# EAGLE design mp3431-led-boost-driver-17mm-mk-1.0.0 (EAGLE 9.2.2)
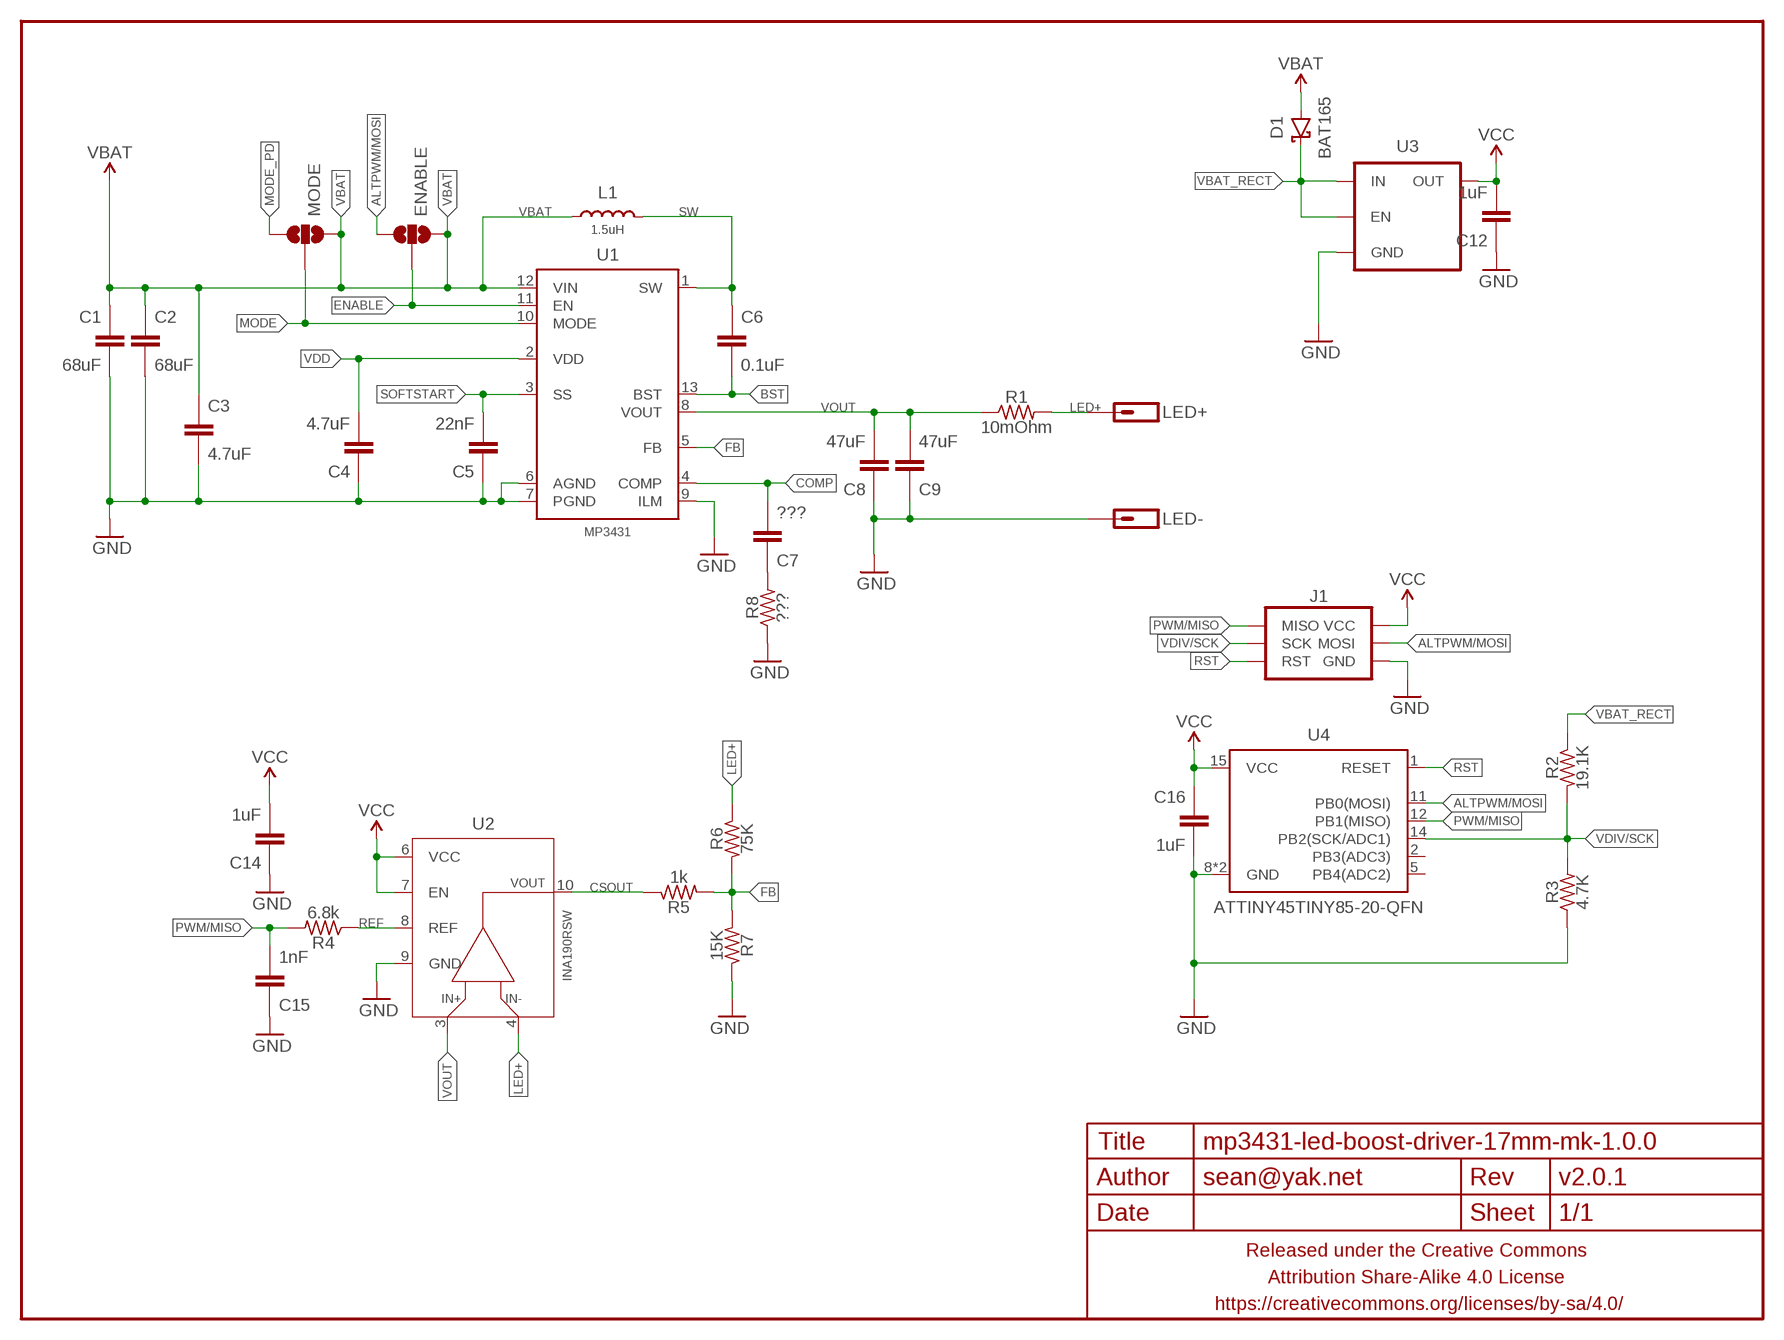
[diagram p0: schematic, sheet 1]

## Parts
C1  68uF  CAPACITOR-CERAMICC1206  [C1206]
C2  68uF  CAPACITOR-CERAMICC1206  [C1206]
C3  4.7uF  CAPACITOR-CERAMICC0402  [C0402]
C4  4.7uF  CAPACITOR-CERAMICC0402  [C0402]
C5  22nF  CAPACITOR-CERAMICC0402  [C0402]
C6  0.1uF  CAPACITOR-CERAMICC0402  [C0402]
C7  ???  CAPACITOR-CERAMICC0402  [C0402]
C8  47uF  CAPACITOR-CERAMICC1206  [C1206]
C9  47uF  CAPACITOR-CERAMICC1206  [C1206]
C12  1uF  CAPACITOR-CERAMICC0402  [C0402]
C14  1uF  CAPACITOR-CERAMICC0402  [C0402]
C15  1nF  CAPACITOR-CERAMICC0402  [C0402]
C16  1uF  CAPACITOR-CERAMICC0402  [C0402]
D1  BAT165  DIODE-SCHOTTKYSOD323  [SOD323-SCHOTTKY]
ENABLE  JUMPER-PAD-3-NOSMALL_BOX_SILK  [PAD-JUMPER-3-NO_YES_SILK_SMALL_BOX]
FRAME1  FRAME-LETTERNO_PACKAGE  [DUMMY]
J1  AVR_SPI_PRG_6SMD-1.27MM  [2X3-1.27MM-SMD]
L1  1.5uH  INDUCTORXAR7030  [XAR7030]
LED+  M01SMD-1.6MMX3.2MM  [1X01-SMD-1.6MMX3.2MM]
LED-  M01SMD-1.6MMX3.2MM  [1X01-SMD-1.6MMX3.2MM]
MODE  JUMPER-PAD-3-NOSMALL_BOX_SILK  [PAD-JUMPER-3-NO_YES_SILK_SMALL_BOX]
R1  10mOhm  RESISTORR1206  [R1206]
R2  19.1K  RESISTORR0402  [R0402]
R3  4.7K  RESISTORR0402  [R0402]
R4  6.8k  RESISTORR0402  [R0402]
R5  1k  RESISTORR0402  [R0402]
R6  75K  RESISTORR0402  [R0402]
R7  15K  RESISTORR0402  [R0402]
R8  ???  RESISTORR0402  [R0402]
U1  MP3431  [MP3431]
U2  INA190RSW  [UQFN-10]
U3  V_REG_ENTLV700  [SC70]
U4  ATTINY45TINY85-20-QFN  [QFN20]

## Nets
ALTPWM/MOSI: ENABLE.3 J1.4(MOSI) U4.11(PB0(MOSI))
BST: C6.2 U1.13(BST)
COMP: C7.2 U1.4(COMP)
COMP_MID: C7.1 R8.2
CSOUT: R5.1 U2.10(OUT)
ENABLE: ENABLE.2 U1.11(EN)
FB: R5.2 R6.2 R7.2 U1.5(FB)
GND: C1.2 C2.2 C3.2 C4.1 C5.1 C8.1 C9.1 C12.1 C14.1 C15.1 C16.2 J1.6(GND) LED-.P$1 R3.1 R7.1 R8.1 U1.6(AGND) U1.7(PGND) U1.9(ILM) U2.9(GND) U3.2(GND) U4.8(GND) U4.PAD(GND)
LED+: LED+.P$1 R1.2 R6.1 U2.4(VIN-)
MODE: MODE.2 U1.10(MODE)
MODE_PD: MODE.3
PWM/MISO: C15.2 J1.1(MISO) R4.2 U4.12(PB1(MISO))
REF: R4.1 U2.8(REF)
RST: J1.5(RST) U4.1(RESET)
SOFTSTART: C5.2 U1.3(SS)
SW: C6.1 L1.P$2 U1.1(SW)
VBAT: C1.1 C2.1 C3.1 D1.A ENABLE.1 L1.P$1 MODE.1 U1.12(VIN)
VBAT_RECT: D1.C R2.1 U3.1(IN) U3.3(EN)
VCC: C12.2 C14.2 C16.1 J1.2(VCC) U2.6(VCC) U2.7(EN) U3.5(OUT) U4.15(VCC)
VDD: C4.2 U1.2(VDD)
VDIV/SCK: J1.3(SCK) R2.2 R3.2 U4.14(PB2(SCK/ADC1))
VOUT: C8.2 C9.2 R1.1 U1.8(VOUT) U2.3(VIN+)
Unconnected: U4.2(PB3(ADC3)) U4.5(PB4(ADC2))

## Library data of the parts
C1-C9 C12 C14-C16 = a_parts:CAPACITOR-CERAMIC: CAPACITOR, European symbol
D1 = a_parts:DIODE-SCHOTTKY: Schottky diodes in SFE's production catalog BAT20J 1A 23V 0.62Vf RB751 120mA 40V 0.37Vf PMEG4005EJ 0.5A 40V 0.42Vf MBRA140 1A 40V 0.5Vf B340A 3A 40V SMA
ENABLE MODE = a_parts:JUMPER-PAD-3-NO
FRAME1 = a_parts:FRAME-LETTER: Schematic Frame Standard 8.5x11 US Letter frame; DESIGNER: sean@yak.net; VERSION: v2.0.1
J1 = a_parts:AVR_SPI_PRG_6: AVR ISP 6 Pin This is the reduced ISP connector for AVR programming. Common on Arduino. This footprint will take up less PCB space and can be used with a 10-pin to 6-pin adapter such as SKU: BOB-08508 **Special note about "TEST_POINT" package. The stop mask is on the top side, so if you want your programming test points to be on the bottom of your board, make sure to place this package on the bottom side of the board. This also ensure that the orientation to program from the bottom side will be correct.
L1 = a_parts:INDUCTOR: Inductors Basic Inductor/Choke - 0603 and 1206. Footprints are not proven and vary greatly between part numbers. SRN6045- 33uH, 20% 1.4A SDR0403-560KL - 56uH, 10%, 500mA RMS/740mA peak
LED+ LED- = a_parts:M01: Header 1 Standard 1-pin 0.1" header. Use with straight break away headers (SKU : PRT-00116), right angle break away headers (PRT-00553), swiss pins (PRT-00743), machine pins (PRT-00117), and female headers (PRT-00115).
R1-R8 = a_parts:RESISTOR: RESISTOR, American symbol
U1 = a_parts:MP3431
U2 = a_parts:INA190
U3 = a_parts:V_REG_EN
U4 = a_parts:ATTINY45: Atmel 8-pin 2/4/8kB flash uC

## Board
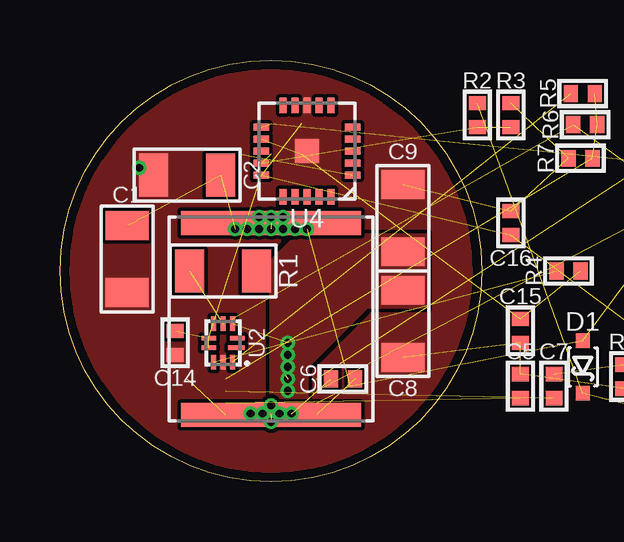
[diagram p1: board, top side]
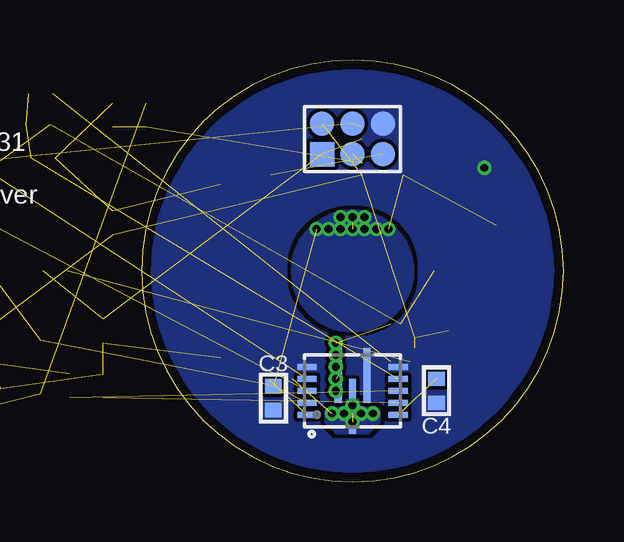
[diagram p2: board, bottom side, seen from below]

Size 17.6 x 17.6 mm. Coordinates in mm from the lower left corner, seen from the top.
Outline: 17.6,8.8 arc-180 0,8.8 arc-180 17.6,8.8
Copper layers (1*16): Top 0.035559375mm / dielectric 1.6mm / Bottom 0.035559375mm
Design rules "oshpark-2layer": minimum track width 6mil, minimum drill 10mil, track to track 6mil, track to pad 6mil, pad to pad 6mil, via to via 6mil, smd to smd 0mil, copper to edge 15mil, drill to drill 6mil, minimum pad ring 5mil, minimum via ring 5mil, stop-mask expansion 2.5mil, vias tented up to drill 20mil, thermal gap 10mil

### Footprints (pad centres in the part's own frame; a part is rotated, then mirrored left to right if it is on the bottom)
C1206 = smd 1.2 x 1.8: 1 -1.4,0; 2 1.4,0
C0402 = smd 0.6 x 0.7: 1 -0.5,0; 2 0.5,0
SOD323-SCHOTTKY = smd 0.6 x 0.6: A -1.1,0; C 1.1,0
PAD-JUMPER-3-NO_YES_SILK_SMALL_BOX = smd 0.8 x 1: 1 -1,0; 2 0,0; 3 1,0
2X3-1.27MM-SMD = smd 1.016 x 1.016: 1 -1.27,-0.635; 2 -1.27,0.635; 3 0,-0.635; 4 0,0.635; 5 1.27,-0.635; 6 1.27,0.635
XAR7030 = smd 1 x 7.5: P$1 -4,0; P$2 4,0
1X01-SMD-1.6MMX3.2MM = smd 1.6 x 3.2: P$1 0,0
R1206 = smd 1.2 x 1.8: 1 -1.4,0; 2 1.4,0
R0402 = smd 0.6 x 0.7: 1 -0.5,0; 2 0.5,0
MP3431 = smd 2.3 x 0.3: 1 -0.65,0; 7 0.65,-0.6; 8 0.65,0.6 | smd 0.25 x 0.8: 2 -1,-1.9; 3 -0.5,-1.9; 4 0,-1.9; 5 0.5,-1.9; 6 1,-1.9; 9 1,1.9; 10 0.5,1.9; 11 0,1.9; 12 -0.5,1.9; 13 -1,1.9
UQFN-10 = smd 0.2 x 0.7: 1 -0.2,-0.55 | smd 0.2 x 0.6: 2 0.2,-0.6; 6 0.2,0.6; 7 -0.2,0.6 | smd 0.6 x 0.2: 3 0.8,-0.4; 4 0.8,0; 5 0.8,0.4; 8 -0.8,0.4; 9 -0.8,0; 10 -0.8,-0.4
SC70 = smd 0.4 x 0.9: 1 -0.65,-1.1; 2 0,-1.1; 3 0.65,-1.1; 4 0.65,1.1; 5 -0.65,1.1
QFN20 = smd 0.65 x 0.3: 1 -1.9,1; 2 -1.9,0.5; 3 -1.9,0; 4 -1.9,-0.5; 5 -1.9,-1; 11 1.9,-1; 12 1.9,-0.5; 13 1.9,0; 14 1.9,0.5; 15 1.9,1 | smd 0.3 x 0.65: 6 -1,-1.9; 7 -0.5,-1.9; 8 0,-1.9; 9 0.5,-1.9; 10 1,-1.9; 16 1,1.9; 17 0.5,1.9; 18 0,1.9; 19 -0.5,1.9; 20 -1,1.9 | smd 1 x 1: PAD 0,0

### Placement (x,y rotation side)
C1  2.8,9.3 270 top
C2  5.3,12.8 180 top
C3  12.1,3.5 270 bottom
C4  5.3,3.8 90 bottom
C5  19.2,4 270 top
C6  11.8,4.3 0 top
C7  20.6,4 270 top
C8  14.3,6.6 90 top
C9  14.3,11 270 top
C12  29.2,4.7 90 top  (outside the outline)
C14  4.8,5.8 90 top
C15  19.2,6.3 90 top
C16  18.8,10.8 90 top
D1  21.8,4.8 270 top  (outside the outline)
ENABLE  28,12.9 180 bottom  (outside the outline)
FRAME1  -0.2,-0.2 270 top
J1  8.8,14.3 0 bottom
L1  8.8,6.8 270 top
LED+  29,9.4 145 top  (outside the outline)
LED-  24.9,7.8 180 top  (outside the outline)
MODE  27.6,15.3 180 bottom  (outside the outline)
R1  6.8,8.8 180 top
R2  17.4,15.3 270 top
R3  18.8,15.3 270 top
R4  21.2,8.8 0 top  (outside the outline)
R5  21.8,16.2 0 top  (outside the outline)
R6  21.9,14.9 0 top  (outside the outline)
R7  21.7,13.5 0 top  (outside the outline)
R8  23.5,4.4 90 top  (outside the outline)
U1  8.8,3.8 90 bottom
U2  6.8,5.8 90 top
U3  26.8,3.7 0 top  (outside the outline)
U4  10.3,13.8 180 top

### Tracks (layer width: path | path; a pad name or v marks a point on that pad's centre or on a via)
ALTPWM/MOSI  (2 unrouted)
BST  (1 unrouted)
COMP  (1 unrouted)
COMP_MID  (1 unrouted)
CSOUT  (1 unrouted)
ENABLE  (1 unrouted)
FB  (3 unrouted)
GND  (via drill 0.33)  (9 unrouted)
  other vias: 3.3,13.1
  pour Top (rank 6, no thermals): -0.2,8.8 arc-180 17.8,8.8 arc-180
  pour Bottom (rank 6, no thermals): -0.2,8.8 arc-180 17.8,8.8 arc-180
LED+  (3 unrouted)
MODE  (1 unrouted)
PWM/MISO  (3 unrouted)
REF  (1 unrouted)
RST  (1 unrouted)
SOFTSTART  (1 unrouted)
SW  (via drill 0.33)  (2 unrouted)
  other vias: 8.8,2.5 8.8,3.2 8.45,2.85 9.15,2.85 7.95,2.85 9.65,2.85
  pour Bottom (no thermals): 8.15,3.4 9.45,3.4 9.9,2.95 9.9,2.5 9.45,2.05 8.15,2.05 7.7,2.5 7.7,2.95
VBAT  (via drill 0.33)  (8 unrouted)
  other vias: 8.8,11.05 9.3,11.05 8.3,11.05 7.8,10.55 8.3,10.55 8.8,10.55 9.3,10.55 9.8,10.55 7.3,10.55 10.3,10.55
  pour Bottom (rank 5): 6.3,8.8 arc-180 11.3,8.8 arc-180
VBAT_RECT  (3 unrouted)
VCC  (7 unrouted)
VDD  (1 unrouted)
VDIV/SCK  (3 unrouted)
VOUT  (via drill 0.33)  (2 unrouted)
  other vias: 9.5,5.3 9.5,4.8 9.5,4.3 9.5,3.8 9.5,5.8
  pour Top (no thermals): 8.8,3.3 8.8,9.2 9.9,10.3 15.3,10.3 15.3,7.3 12.8,7.3 10.3,4.8 10.3,3.3

### Text on the board
bPlace: MP3431 | LED Driver